# Altium schematic sheet PowerSupply.SchDoc
size 353 x 250 mm; Date: 17.10.2024r.; Author: Bartlomiej Smoter; CompanyName: AGH Racing; Revision: v1; SheetNumber: 2; SheetTotal: 6
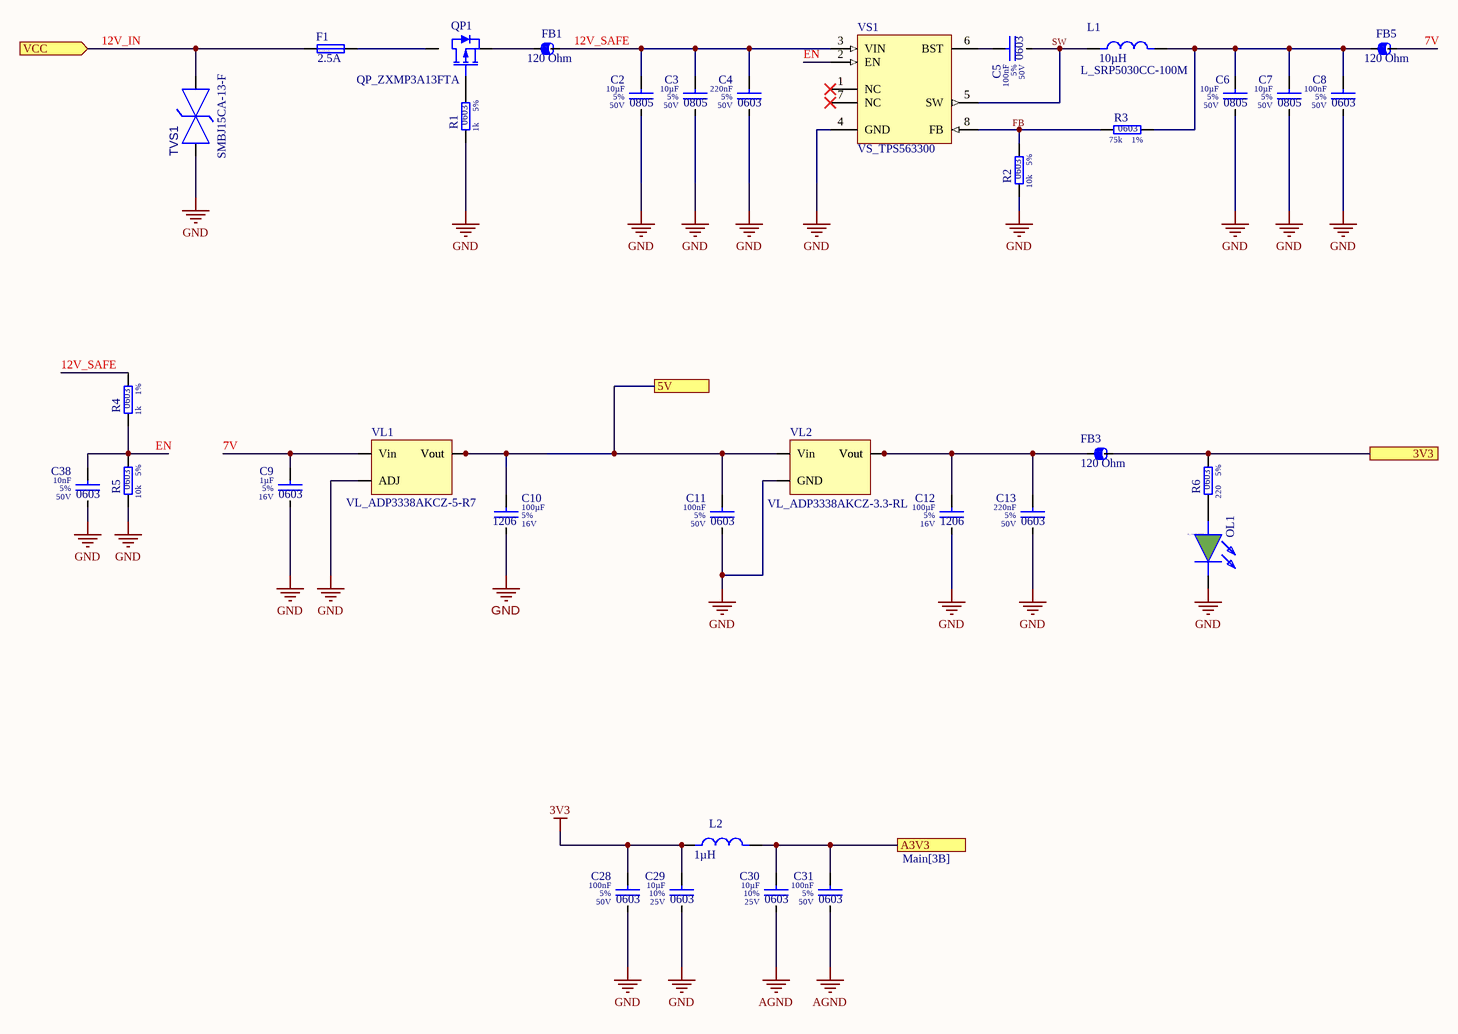
[diagram p0: PowerSupply.SchDoc]

## Parts
C2  value 10µF  Tolerance: 5%  Voltage Rating: 50V  Case/Package: 0805  [0805_Capacitor]  (hidden comment: C_10u_50V_0805_10)
C3  value 10µF  Tolerance: 5%  Voltage Rating: 50V  Case/Package: 0805  [0805_Capacitor]  (hidden comment: C_10u_50V_0805_10)
C4  value 220nF  Tolerance: 5%  Voltage Rating: 50V  Case/Package: 0603  [0603_HandSold_Capacitor]  (hidden comment: C_220n_50V_0603_5)
C5  value 100nF  Tolerance: 5%  Voltage Rating: 50V  Case/Package: 0603  [0603_HandSold_Capacitor]  (hidden comment: C_100n_50V_0603_5)
C6  value 10µF  Tolerance: 5%  Voltage Rating: 50V  Case/Package: 0805  [0805_Capacitor]  (hidden comment: C_10u_50V_0805_10)
C7  value 10µF  Tolerance: 5%  Voltage Rating: 50V  Case/Package: 0805  [0805_Capacitor]  (hidden comment: C_10u_50V_0805_10)
C8  value 100nF  Tolerance: 5%  Voltage Rating: 50V  Case/Package: 0603  [0603_HandSold_Capacitor]  (hidden comment: C_100n_50V_0603_5)
C9  value 1µF  Tolerance: 5%  Voltage Rating: 16V  Case/Package: 0603  [0603_HandSold_Capacitor]  (hidden comment: C_1u_16V_0603_5)
C10  value 100µF  Tolerance: 5%  Voltage Rating: 16V  Case/Package: 1206  [1206_HandSold_Capacitor]  (hidden comment: C_100u_16V_1206_5)
C11  value 100nF  Tolerance: 5%  Voltage Rating: 50V  Case/Package: 0603  [0603_HandSold_Capacitor]  (hidden comment: C_100n_50V_0603_5)
C12  value 100µF  Tolerance: 5%  Voltage Rating: 16V  Case/Package: 1206  [1206_HandSold_Capacitor]  (hidden comment: C_100u_16V_1206_5)
C13  value 220nF  Tolerance: 5%  Voltage Rating: 50V  Case/Package: 0603  [0603_HandSold_Capacitor]  (hidden comment: C_220n_50V_0603_5)
C28  value 100nF  Tolerance: 5%  Voltage Rating: 50V  Case/Package: 0603  [0603_HandSold_Capacitor]  (hidden comment: C_100n_50V_0603_5)
C29  value 10µF  Tolerance: 10%  Voltage Rating: 25V  Case/Package: 0603  [0603_HandSold_Capacitor]  (hidden comment: C_10u_25V_0603_10)
C30  value 10µF  Tolerance: 10%  Voltage Rating: 25V  Case/Package: 0603  [0603_HandSold_Capacitor]  (hidden comment: C_10u_25V_0603_10)
C31  value 100nF  Tolerance: 5%  Voltage Rating: 50V  Case/Package: 0603  [0603_HandSold_Capacitor]  (hidden comment: C_100n_50V_0603_5)
C38  value 10nF  Tolerance: 5%  Voltage Rating: 50V  Case/Package: 0603  [0603_HandSold_Capacitor]  (hidden comment: C_10n_50V_0603_5)
F1  F_1210_2.5A  Trip Current: 2.5A  [1210]
FB1  Impedance: 120 Ohm  [0805_FB]  (hidden comment: FB_BLM21PG121SN1D)
FB3  Impedance: 120 Ohm  [0805_FB]  (hidden comment: FB_BLM21PG121SN1D)
FB5  Impedance: 120 Ohm  [0805_FB]  (hidden comment: FB_BLM21PG121SN1D)
L1  L_SRP5030CC-100M  value 10µH  [L_2220]
L2  value 1µH  [0805_HandSold_Inductor]  (hidden comment: L_TMS201610ALM-1R0MTAA)
OL1  OL_150060VS75000  [0603_HandSold_LED]
QP1  QP_ZXMP3A13FTA  [SOT23]
R1  Tolerance: 5%  Resistance: 1k  Case/Package: 0603  [0603_HandSold_Resistor]  (hidden comment: R_1k_0603_5)
R2  Tolerance: 5%  Resistance: 10k  Case/Package: 0603  [0603_HandSold_Resistor]  (hidden comment: R_10k_0603_5)
R3  Tolerance: 1%  Resistance: 75k  Case/Package: 0603  [0603_HandSold_Resistor]  (hidden comment: R_75k_0603_1)
R4  Tolerance: 1%  Resistance: 1k  Case/Package: 0603  [0603_HandSold_Resistor]  (hidden comment: R_27k_0603_1)
R5  Tolerance: 5%  Resistance: 10k  Case/Package: 0603  [0603_HandSold_Resistor]  (hidden comment: R_10k_0603_5)
R6  Tolerance: 5%  Resistance: 220  Case/Package: 0603  [0603_HandSold_Resistor]  (hidden comment: R_220_0603_5)
TVS1  Man. Part Num.: SMBJ15CA-13-F  [DO-214AA (SMB J-Bend) footprint]  (hidden comment: TVS_SMBJ15CA-13-F)
VL1  VL_ADP3338AKCZ-5-R7  [SOT223-3]
VL2  VL_ADP3338AKCZ-3.3-RL  [SOT223-3]
VS1  VS_TPS563300  [SOT-5X3-8]

## Ports
3V3 (see Main[3A]), 5V (see Main[3A]), A3V3 (see Main[3B]), VCC (in, see Main[2A])

## Nets
3V3: C28.1 C29.1 L2.1
AGND: C30.2 C31.2
GND: C2.2 C3.2 C4.2 C6.2 C7.2 C8.2 C9.2 C10.2 C11.2 C12.2 C13.2 C28.2 C29.2 C38.2 OL1.1(K) R1.1 R2.1 R5.1 TVS1.1 VL1.1(ADJ) VL2.1(GND) VS1.4(GND)
3V3: FB3.2 R6.2 ; port 3V3  [a separate net that carries the same name]
5V: C10.1 C11.1 VL1.2(Vout) VL1.4(Vout) VL2.3(Vin) ; port 5V
7V: C9.1 FB5.2 VL1.3(Vin)
12V_IN: F1.1 TVS1.2 ; port VCC
12V_SAFE: C2.1 C3.1 C4.1 FB1.2 R4.2 VS1.3(VIN)
A3V3: C30.1 C31.1 L2.2 ; port A3V3
EN: C38.1 R4.1 R5.2 VS1.2(EN)
FB: R2.2 R3.1 VS1.8(FB)
SW: C5.2 L1.1 VS1.5(SW)
NetC5_1: C5.1 VS1.6(BST)
NetC6_1: C6.1 C7.1 C8.1 FB5.1 L1.2 R3.2
NetC12_1: C12.1 C13.1 FB3.1 VL2.2(Vout) VL2.4(Vout)
NetF1_2: F1.2 QP1.3(D)
NetFB1_1: FB1.1 QP1.2(S)
NetOL1_2: OL1.2(A) R6.1
NetQP1_1: QP1.1(G) R1.2

Not connected (* = marked no-connect by the designer): VS1 1(NC)* 7(NC)*

## Notes on the sheet
- Name:
- Author:
- Project:
- Revision:
- Date:

## Library data of the parts
C2 C3 C6 C7 = CMP-001-00003-15: Capacitor Type: Ceramic; Revision Num.: 1; HelpURL: https://www.tme.eu/Document/58bb7db4269ac3ad53d1aa3c0ade9bab/GRM.pdf; Mounting Technology: SMT
C4 C13 = CMP-001-00023-24: Revision Num.: 1; Capacitor Type: Ceramic; HelpURL: https://www.mouser.pl/datasheet/2/40/KGM_X7R-3223212.pdf; Mounting Technology: SMT
C5 C8 C11 = CMP-001-00008-25: Capacitor Type: Ceramic; Revision Num.: 1; Mounting Technology: SMT; HelpURL: https://www.tme.eu/Document/78f46414e6dac38b7cca12338ea208b0/X7RDielectric.pdf
C9 = CMP-001-00014-23: Revision Num.: 1; Capacitor Type: Ceramic; HelpURL: https://eu.mouser.com/datasheet/2/40/KGM_X7R-3223212.pdf; Mounting Technology: SMT
C10 C12 = CMP-001-00056-1: Revision Num.: 0; Capacitor Type: Ceramic; Mounting Technology: SMT; HelpURL: https://www.tme.eu/Document/7e71bc7e80441897b2dc5cf4de77e476/c-series_en.pdf
C28 C31 = CMP-001-00008-26: Capacitor Type: Ceramic; Revision Num.: 1; HelpURL: https://www.tme.eu/Document/78f46414e6dac38b7cca12338ea208b0/X7RDielectric.pdf; Mounting Technology: SMT
C29 C30 = CMP-001-00061-2: C_10u_10V_0603_10; Capacitor Type: Ceramic; Revision Num.: 1; Mounting Technology: SMT; HelpURL: https://www.tme.eu/Document/58bb7db4269ac3ad53d1aa3c0ade9bab/GRM.pdf
C38 = CMP-001-00009-25: Capacitor Type: Ceramic; Revision Num.: 1; Mounting Technology: SMT; HelpURL: https://www.tme.eu/Document/78f46414e6dac38b7cca12338ea208b0/X7RDielectric.pdf
F1 = CMP-005-00012-5: Fuse; Resettable; MF-USHT; 0.5A, 2.5A, 20A; 30V, smt; Man. Part Num.: MF-USHT050KX-2; Revision Num.: 1.1; Hold Current: 500mA; Current Rating: 20A; Mounting Technology: SMT; Series: MF-USHT; Case/Package: 1210; Maximum Voltage: 30V; HelpURL: https://www.mouser.pl/datasheet/2/54/mf_usht-1128467.pdf
FB1 = CMP-006-00000-8: Ferrite Beads 120 OHM 25% Alternate Sizing Guide Below; ESR: 30m; Current Rating: 3A; Revision Num.: Revision #1; Mounting Technology: SMT; Man. Part Num.: BLM21PG121SN1D; Case/Package: 0805; HelpURL: https://www.mouser.pl/datasheet/2/281/ENFA0005-1915781.pdf
FB3 FB5 = CMP-006-00000-9: Ferrite Beads 120 OHM 25% Alternate Sizing Guide Below; Revision Num.: Revision #1; ESR: 30m; Current Rating: 3A; Case/Package: 0805; HelpURL: https://www.mouser.pl/datasheet/2/281/ENFA0005-1915781.pdf; Mounting Technology: SMT; Man. Part Num.: BLM21PG121SN1D
L1 = CMP-031-00003-1: SMD Ind,5.7x5.2x2.8mm,10uH+/-20%,2.8A,shd; ESR: 0.102; HelpURL: https://www.mouser.pl/datasheet/2/54/Bourns_07202023_SRP5030CC-3247830.pdf; Current Rating: 2.8A; Man. Part Num.: SRP5030CC-100M; Mounting Technology: SMT; Case/Package: 2220
L2 = CMP-006-00019-2: Inductor; 1uH, 3.1A, 60mΩ, 20%, SMT; ESR: 60m; Revision Num.: 0; HelpURL: https://product.tdk.com/system/files/dam/doc/product/inductor/inductor/smd/catalog/inductor_commercial_power_tms201610alm_en.pdf; Case/Package: 0805; Mounting Technology: SMT; Current Rating: 3.1A; Tolerance: 20%; Man. Part Num.: TMS201610ALM-1R0MTAA
OL1 = CMP-007-00000-15: LED, 0603 Green 2V 30mA  72mW; Revision Num.: 1; Forward Voltage: 2V; Case/Package: 0603; Man. Part Num.: 150060VS75000; Mounting Technology: SMT; Colour: Green; Forward Current: 30mA; Power: 72mW; HelpURL: https://www.mouser.pl/datasheet/2/445/150060VS75000-3085276.pdf
QP1 = CMP-013-00002-22: MOSFET 30V P-Chnl UMOS; Vds / Vce: -30V; Transistor Type: PMOSFET; Vgs / Vbe: -1V; Id / Ic: -1.4A; Power: 625mW; Rds / Rce: 0.33; Revision Num.: Revision #1; Case/Package: SOT23; Mounting Technology: SMT; HelpURL: https://www.diodes.com/assets/Datasheets/ZXMP3A13F.pdf; Man. Part Num.: ZXMP3A13FTA
R1 = CMP-009-00001-19: Revision Num.: 1; Voltage Rating: 75V; Power: 100mW; HelpURL: https://eu.mouser.com/datasheet/2/447/YAGEO_PYu_RC_Group_51_RoHS_L_12-3313492.pdf; Mounting Technology: SMT
R2 R5 = CMP-009-00002-20: Power: 100mW; Voltage Rating: 50V; Revision Num.: 1; HelpURL: https://www.tme.eu/Document/d2a72e545e5c8eb7bf2a04fa97535928/rc0603yageo.pdf; Mounting Technology: SMT
R3 = CMP-009-00121-1: Voltage Rating: 75V; Power: 100mW; Mounting Technology: SMT; HelpURL: https://eu.mouser.com/datasheet/2/315/AOA0000C304-1149620.pdf
R4 = CMP-009-00162-1: Voltage Rating: 75V; Power: 100mW; Revision Num.: 1; Mounting Technology: SMT; HelpURL: https://www.tme.eu/Document/622e28308c06d160637f2b14751ba16b/Data%20Sheet%20CRCW_BCe3.pdf
R6 = CMP-009-00033-15: Power: 100mW; Revision Num.: 1; Voltage Rating: 50V; Mounting Technology: SMT; HelpURL: https://www.mouser.pl/datasheet/2/315/AOA0000C334-1314047.pdf
TVS1 = CMP-00063-1: Diode; TVS; Bidirectional; 15V, 16.7V, 24.4V SMT; HelpURL: https://www.mouser.pl/datasheet/2/115/DIOD_S_A0003133144_1-2542279.pdf; Working Voltage: 15V; Breakdown Voltage: 16.7V; Case/Package: DO-214AA; Polarity: Bidirectional; Clamping Voltage: 24.4V; Mounting Technology: SMT
VL1 = CMP-019-00038-1: LDO; ADP3338AKCZ-5-R7; 1A; 5V; High accuracy over line and load: ±0.8% @ 25°C,; Revision Num.: 1; Power: 5W; Min Supply Voltage: -300mV; Max Supply Voltage: 8.5V; Case/Package: SOT223-3; Max Output Voltage: 5V; Mounting Technology: SMT; Min Output Voltage: 5V; HelpURL: https://www.mouser.pl/datasheet/2/609/ADP3338-1503401.pdf; Man. Part Num.: ADP3338AKCZ-5-R7; Series: ADP3338; Output Current: 1A
VL2 = CMP-019-00039-1: LDO; ADP3338AKCZ-5-R7; 1A; 3.3V; High accuracy over line and load: ±0.8% @ 25°C,; Min Supply Voltage: -300mV; Revision Num.: 1; Power: 5W; Max Supply Voltage: 8.5V; Series: ADP3338; Output Current: 1A; Case/Package: SOT223-3; Man. Part Num.: ADP3338AKCZ-3.3-RL; HelpURL: https://www.mouser.pl/datasheet/2/609/ADP3338-1503401.pdf; Min Output Voltage: 3.3V; Max Output Voltage: 3.3V; Mounting Technology: SMT
VS1 = CMP-019-00023-2: DC/DC Buck; 3.8-V to 28-V, 3-A Synchronous Buck Converter in SOT583 Package; Man. Part Num.: TPS563300DRLR; Revision Num.: 0; Max Supply Voltage: 28V; Max Output Voltage: 22V; Output Current: 3A; Min Output Voltage: 800mV; Min Supply Voltage: 3.8V; HelpURL: https://www.ti.com/lit/ds/symlink/tps563300.pdf?ts=1715787860656&ref_url=https%253A%252F%252Fwww.mouser.co.uk%252F; Mounting Technology: SMT; Case/Package: SOT582